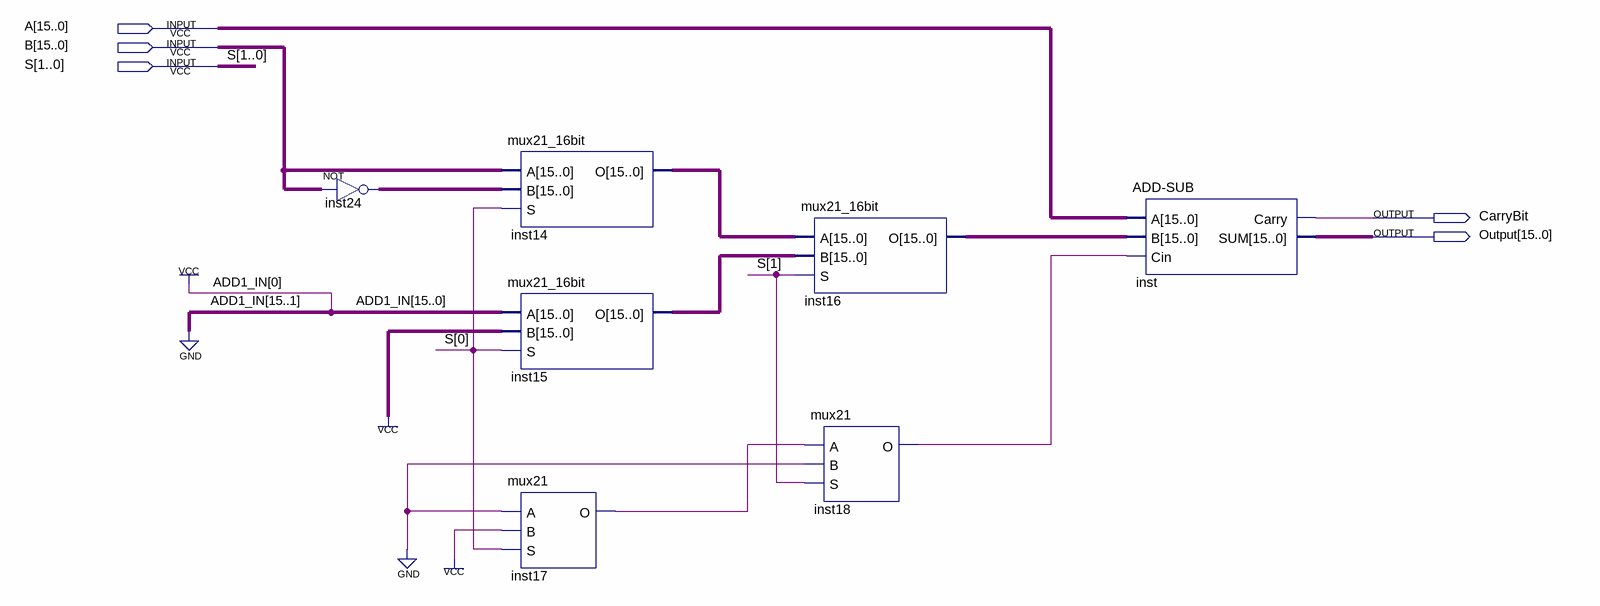
[diagram p0: schematic sheet]
// Quartus schematic khoiCongTru.bdf as structural Verilog: 7 symbols, 5 pins
module khoiCongTru (
  input  [15:0] A,
  input  [15:0] B,
  input  [1:0] S,
  output CarryBit,
  output [15:0] Output
);

  wire inst17_o, inst18_o;
  wire [15:0] inst14_o, inst15_o, inst16_o, inst24_out;

  assign inst24_out = ~B;  // NOT inst24, 16 bits wide
  mux21_16bit inst14 (.A(B), .B(inst24_out), .S(S[0]), .O(inst14_o));
  mux21_16bit inst15 (.A(16'b0000000000000001), .B({16{1'b1}}), .S(S[0]), .O(inst15_o));
  mux21 inst17 (.A(1'b0), .B(1'b1), .S(S[0]), .O(inst17_o));
  mux21_16bit inst16 (.A(inst14_o), .B(inst15_o), .S(S[1]), .O(inst16_o));
  mux21 inst18 (.A(inst17_o), .B(1'b0), .S(S[1]), .O(inst18_o));
  \ADD-SUB  inst (.A(A), .B(inst16_o), .Cin(inst18_o), .Carry(CarryBit), .SUM(Output));
endmodule
